# Altium schematic sheet Sheet1.SchDoc
size A; SheetNumber: 1; SheetTotal: 1
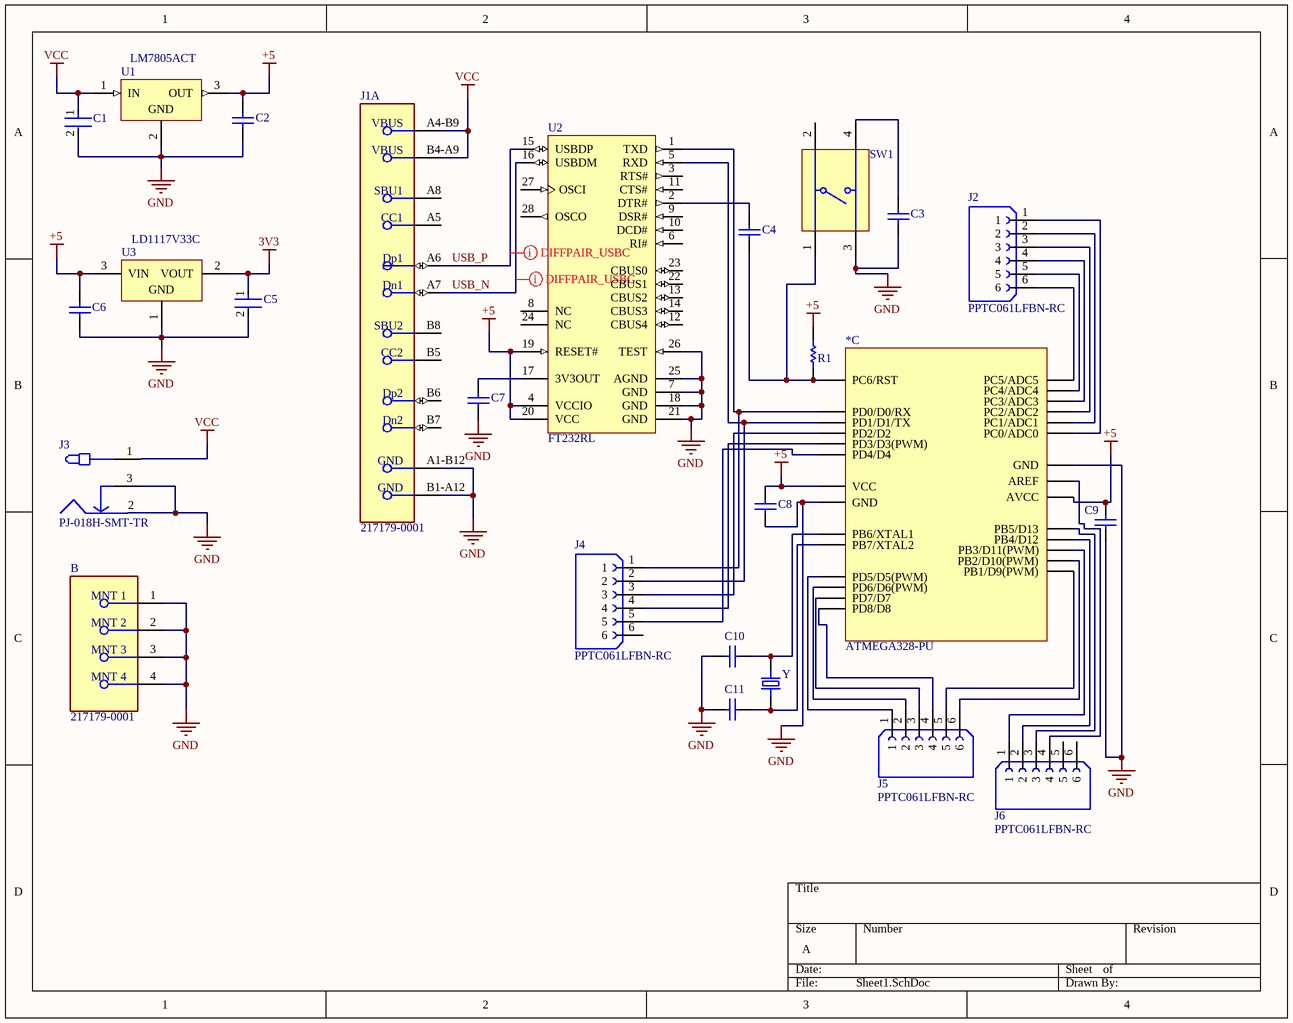
[diagram p0: Sheet1.SchDoc]

## Parts
*  ATMEGA328-PU  [atmega v2 - duplicate]  (part C of 3)
?  217179-0001  [FP-2171790001-MFG]  (part B of 2)
C1  C0805C334K5RACTU  [FP-C0805C-DN-MFG]  (value not drawn)
C2  C0402C104K4RACTU  [CAPC1005X55X30LL05T10]  (value not drawn)
C3  C0402C104K4RACTU  [CAPC1005X55X30LL05T10]  (value not drawn)
C4  C1206C105K5RACTU  [CAPC3216X110X50LL20T25]  (value not drawn)
C5  GRM188R60J106ME47D  [FP-GRM188-0_1-e0_2_0_55-IPC_A]  (value not drawn)
C6  C0402C104K4RACTU  [CAPC1005X55X30LL05T10]  (value not drawn)
C7  C0402C104K4RACTU  [CAPC1005X55X30LL05T10]  (value not drawn)
C8  C0402C104K4RACTU  [CAPC1005X55X30LL05T10]  (value not drawn)
C9  C0402C104K4RACTU  [CAPC1005X55X30LL05T10]  (value not drawn)
C10  GRM1885C1H220JA01D  [CAPC1608X90X35ML10T15]  (value not drawn)
C11  GRM1885C1H220JA01D  [CAPC1608X90X35ML10T15]  (value not drawn)
J1  217179-0001  [FP-2171790001-MFG]  (part A of 2)
J2  PPTC061LFBN-RC  [SULLINS_PPTC061LFBN-RC]
J3  PJ-018H-SMT-TR  [FP-PJ-018H-SMT-TR-MFG]
J4  PPTC061LFBN-RC  [SULLINS_PPTC061LFBN-RC]
J5  PPTC061LFBN-RC  [SULLINS_PPTC061LFBN-RC]
J6  PPTC061LFBN-RC  [SULLINS_PPTC061LFBN-RC]
R1  CRCW060310K0FKEA  [RESC1609X50X30NL8T20]  (value not drawn)
SW1  1825910-6  [TECO-1825910-6_V]  (value not drawn)
U1  LM7805ACT  [FAIR-TO-220-3]
U2  FT232RL  [FTDI-SSOP-28_M]
U3  LD1117V33C  [TO220]
Y  ECS-160-20-3X-TR  [XTAL_ECS-160-20-3X-TR]  (value not drawn)

## Nets
3V3: C5.1 U3.2(VOUT)
+5: *.7(VCC) *.20(AVCC) C2.2 C6.2 C8.2 C9.2 R1.1 U1.3(OUT) U2.4(VCCIO) U2.19(RESET#) U2.20(VCC) U3.3(VIN)
GND: *.8(GND) *.22(GND) ?.1(MNT_1) ?.2(MNT_2) ?.3(MNT_3) ?.4(MNT_4) C1.2 C2.1 C3.1 C5.2 C6.1 C7.1 C8.1 C9.1 C10.1 C11.1 J1.A1-B12(GND) J1.B1-A12(GND) J3.2 J3.3 SW1.3 U1.2(GND) U2.7(GND) U2.18(GND) U2.21(GND) U2.25(AGND) U2.26(TEST) U3.1(GND)
VCC: C1.1 J1.A4-B9(VBUS) J1.B4-A9(VBUS) J3.1 U1.1(IN)
USB_N: J1.A7(Dn1) U2.16(USBDM)
USB_P: J1.A6(Dp1) U2.15(USBDP)
Net*_1: *.1(PC6/RST) C4.1 R1.2 SW1.1
Net*_2: *.2(PD0/D0/RX) J4.1 U2.1(TXD)
Net*_3: *.3(PD1/D1/TX) J4.2 U2.5(RXD)
Net*_4: *.4(PD2/D2) J4.3
Net*_5: *.5(PD3/D3(PWM)) J4.4
Net*_6: *.6(PD4/D4) J4.5
Net*_9: *.9(PB6/XTAL1) C10.2 Y.1
Net*_10: *.10(PB7/XTAL2) C11.2 Y.2
Net*_11: *.11(PD5/D5(PWM)) J5.1
Net*_12: *.12(PD6/D6(PWM)) J5.2
Net*_13: *.13(PD7/D7) J5.3
Net*_14: *.14(PD8/D8) J5.4
Net*_15: *.15(PB1/D9(PWM)) J5.5
Net*_16: *.16(PB2/D10(PWM)) J5.6
Net*_17: *.17(PB3/D11(PWM)) J6.1
Net*_18: *.18(PB4/D12) J6.2
Net*_19: *.19(PB5/D13) J6.3
Net*_21: *.21(AREF) J6.4
Net*_23: *.23(PC0/ADC0) J2.1
Net*_24: *.24(PC1/ADC1) J2.2
Net*_25: *.25(PC2/ADC2) J2.3
Net*_26: *.26(PC3/ADC3) J2.4
Net*_27: *.27(PC4/ADC4) J2.5
Net*_28: *.28(PC5/ADC5) J2.6
NetC3_2: C3.2 SW1.4
NetC4_2: C4.2 U2.2(DTR#)
NetC7_2: C7.2 U2.17(3V3OUT)

Not connected (* = marked no-connect by the designer): J1 A5(CC1) A8(SBU1) B5(CC2) B6(Dp2) B7(Dn2) B8(SBU2); J4 6; J6 5 6; SW1 2; U2 3(RTS#) 6(RI#) 8(NC) 9(DSR#) 10(DCD#) 11(CTS#) 12(CBUS4) 13(CBUS2) 14(CBUS3) 22(CBUS1) 23(CBUS0) 24(NC) 27(OSCI) 28(OSCO)

## Layout directives
differential pair; differential pair class USB_DIFF; net class USB_DIFFPAIR: USB_N, USB_P

## Library data of the parts
* = ATMEGA328-PU: MCU 8-bit ATmega AVR RISC 32KB Flash 2.5V/3.3V/5V 28-Pin PDIP - Rail/Tube; Manufacturer: Microchip; Supplier: Rs; Supplier Part Number: 1310277P; Manufacturer Part Number: ATMEGA328-PU; RoHS: Yes; Category: Microcontrollers; Stock: 1128; Pricing: 25=2.048, 100=1.972 (GBP); Lead Free: 5697LeadFree
? J1 = CMP-04767-000028-2: CONN RCP USB2.0 TYP C 24P SMD RA; NexarPartId: 117190526; Gender: Receptacle; Number of Contacts: 16; Current Rating: 1.25A; Voltage Rating: 30V; Min Operating Temperature: -40°C; USB Standard: USB 2.0; Height: 3.36mm; Contact Material: Gold, Nickel; Max Operating Temperature: 85°C
C1 = CMP-1036-04607-3: CAP CER 0.33UF 50V X7R 0805; Manufacturer: KEMET; Temperature Coefficient: 30ppm/°C; Value: 0.33 μF; Material: Ceramic; Tolerance: 0.1; Temperature: -55°C to +125°C; Temperature Range Low: -55°C; Voltage Rating: 50 V; Lead Free: Yes; Mouser Description: Multilayer Ceramic Capacitors MLCC - SMD/SMT 50volts 0.33uF 10% X7R; Manufacturer Part Number: C0805C334K5RACTU; Automotive: No; Package: C0805C-DN; Temperature Characteristic: X7R; Capacitance: 0.33 μF; Digikey Description: CAP CER 0.33UF 50V X7R 0805; Device Class L3: Ceramic Capacitors; Temperature Range High: +125°C; Category: Cap; Ipc Land Pattern Name: CAPC200125X78; ComponentLink2URL: https://content.kemet.com/datasheets/KEM_C1003_C0G_SMD.pdf; ComponentLink2Description: Datasheet; RoHS: TRUE; Device Class L1: Passive Components; Height: 0.88mm; Octopart: https://octopart.com/c0805c334k5ractu-kemet-10475704; Device Class L2: Capacitors
C2 C3 C6-C9 = CMP-0001-00074-2: 0.1uf; Manufacturer: Kemet; Part Number: C0402C104K4RACTU
C4 = CMP-2000-06011-1: Chip Capacitor, 1 uF, +/- 10%, 50 V, -55 to 125 degC, 1206 (3216 Metric), RoHS, Tape and Reel; Manufacturer: Kemet; Case Height: 1mm; Dielectric: X7R; Voltage Rating: 50V; Capacitance: 1uF; Temperature Coefficient / Code: +/-15%; Case Length: 3.2mm; Case Width: 1.6mm; Type: SMDMLCCX7R6.3-250VDCCommericalGrade; Class: Class1; Capacitance - nF: 1000nF; Datasheet URL: http://www.kemet.com/docfinder?Partnumber=C1206C105K5RACTU; Product Category: MultilayerCeramicCapacitorsMLCC-SMD/SMT; Termination Style: SMD/SMT; Dimensions: 1.6mmWx3.2mmLx1mmH; Voltage Rating DC: 50V; Datasheet Version: 02/2016; Packaging: Reel; Brand: Kemet; RoHS: Details; Minimum Operating Temperature: -55C; Operating Temperature Range: -55Cto+125C; Package Reference: 1206; Manufacturer URL: http://www.kemet.com/; Product: GeneralTypeMLCCs; Tolerance: 10%; Package Description: 2-Pin Surface Mount Device, Body 3.2 x 1.6 mm; Mounting Technology: SurfaceMount; Case Code - mm: 3216; Maximum Operating Temperature: +125C; Series: C1206C; Factory Pack Quantity: 2500; Package / Case: 1206(3216metric); Case Code - in: 1206
C5 = CMP-2006-02792-2: Chip Multilayer Ceramic Capacitors for General Purpose, 0603, 10uF, X5R, 15%, 20%, 6.3V; Packaging: Tape and Reel; Voltage Rating (DC): 6.3V; Width: 0.031inch; Termination: SMD/SMT; Dielectric: X5R; Package Quantity: 4000; Voltage Rating: 6.3V; Capacitance: 10uF; Case/Package: 0603; Min Operating Temperature: -55°C; Voltage: 6.3V; Length: 1.6mm; Thickness: 0.035inch; Lead Free: Lead Free; Depth: 0.8mm; Case Code (Imperial): 0603; Max Operating Temperature: 85°C; Material: Ceramic; Height: 0.8mm; Tolerance: 20%; Mount: Surface Mount; REACH SVHC: No SVHC; Radiation Hardening: No; Case Code (Metric): 1608
C10 C11 = CMP-2000-04945-1: Chip Capacitor, 22 pF, +/- 5%, 50 V, -55 to 125 degC, 0603 (1608 Metric), RoHS, Tape and Reel; Manufacturer: Murata; Capacitance: 22pF; Rated Voltage: 50V; Dielectric: C0G; Manufacturer URL: http://www.murata.com/; Datasheet Version: Jul-06; Package Reference: 603; Tolerance (%): ±5%; Case Size/Dimension: 0603; Package Description: 2-Pin Surface Mount Device, Body 1.6 x 0.8 mm; Datasheet URL: https://datasheet.ciiva.com/11786/0900766b807a1cab-11786398.pdf
J2 J4-J6 = PPTC061LFBN-RC: 6 Position Header Connector 0.100 (2.54mm) Through Hole Tin; MF: Sullins Connector; SnapEDA_Link: https://www.snapeda.com/parts/PPTC061LFBN-RC/Sullins+Connector+Solutions/view-part/?ref=snap; Package: None; Value: *; MP: PPTC061LFBN-RC; Check_prices: https://www.snapeda.com/parts/PPTC061LFBN-RC/Sullins+Connector+Solutions/view-part/?ref=eda
J3 = CMP-14830-000007-1: CONN PWR JACK 1.7X4MM SOLDER; Manufacturer: CUI; Current Rating: 5A; Conn Orientation: Right Angle; Standoff Height: 0.1mm; Conn Gender: Male; Number Of Contacts: 1; Voltage Rating: 24V; Device Class L3: unset; Digikey Description: CONN PWR JACK 1.7X4MM SOLDER; Mouser Description: DC Power Connectors Power Jacks; Category: Conn; Temperature: -25°C to +85°C; Temperature Range High: +85°C; Device Class L2: Power Connectors; Package: 0; Octopart: https://octopart.com/pj-018h-smt-tr-cui-25947163; Automotive: No; Manufacturer Part Number: PJ-018H-SMT-TR; Device Class L1: Connectors; Height: 5.6mm; RoHS: TRUE; Temperature Range Low: -25°C; Contact Material: Nickel,Silver; Lead Free: Yes; ComponentLink2Description: Datasheet; ComponentLink2URL: https://www.cuidevices.com/product/resource/pj-018h-smt-tr.pdf
R1 = CMP-1666-00005-4: Chip Resistor, 10 KOhm, +/- 1%, 100 mW, -55 to 155 degC, 0603 (1608 Metric), RoHS, Tape and Reel; Manufacturer: Vishay Semiconductor; Voltage Rating: 75 V; Max Operating Temperature: 155 degC; PackageDescription: 2-Pin Surface Mount Device, Body 1.575 x 0.85 mm; ComponentLink1Description: Manufacturer URL; RoHSCompliant: true; PackageReference: 0603; REACH SVHC: Unknown; Length: 1.55 mm; DatasheetVersion: 06/2012; Packaging: Tape and Reel; Min Operating Temperature: -55 degC; Mounting Technology: Surface Mount; ComponentLink2URL: https://datasheet.ciiva.com/11809/0900766b80d98afc-11809037.pdf; Height: 0.45 mm; ComponentLink2Description: Datasheet; Package Quantity: 5000; ComponentLink1URL: http://www.vishay.com/
SW1 = CMP-1684-00021-1: Tact Switch, SPST-NO, 0.05 A, -35 to 85 degC, 4-Pin THD, RoHS, Bulk; Manufacturer: TE Connectivity; Maximum Contact Resistance: 100mOhm; Mechanical Life: 100000Cycles; Bushing Type: Unthreaded; Switch Configuration: OFF(ON); Maximum DC Voltage Rating: 24V; Contact Rating @ Voltage: 0.05A@24VDC; Actuator Color: Black; Body Orientation: Straight; Function: MomentaryContact; Illumination: N/R; Actuator Style: RoundButton; Actuator Material: PolybutyleneTerephthalate; Dielectric Strength: 500VAC; Pole Throw Configuration: SPST; Actuator Length: 1.4mm; Product Weight: N/A; Contact Material: CopperAlloy; Housing Material: N/A; Terminal Type: PCPins; Minimum Insulation Resistance: 100MOhm; Package Description: 4-Pin Through Hole Device, Body 5.99 x 5.99 mm, Pitch 6.5 mm; Part No: 1825910-6; Package Reference: THD; Base Material: N/A; Manufacturer URL: http://www.te.com; Contact Plating: Silver; RoHS: Yes; Datasheet Version: Rev. C9; Electrical Life: 100000Cycles; Maximum AC Voltage Rating: N/A; Thread Size: N/R; Operating Temperature: -35to85C; Mounting: ThroughHole; Dimension: 5.99x5mm; Datasheet URL: http://www.te.com/commerce/DocumentDelivery/DDEController?Action=showdoc&DocId=Customer+Drawing%7F1825910%7FC9%7Fpdf%7FEnglish%7FENG_CD_1825910_C9.pdf%7F1825910-6; Family: 1825910; Seal Location: N/A; Seal Description: N/A; Packaging: N/A
U1 = CMP-2000-04937-1: Positive Voltage Regulator, 5 V, 1 A, 0 to 125 degC, 3-Pin TO-220, RoHS, Tube; Manufacturer: Fairchild; Number of Outputs: 1; Typical Dropout Voltage @ Current: 2V@1A; Output Type: Fixed; Output Voltage: 5V; Quiescent Current: 6mA; Dropout Voltage Measurement Current: 1A; Line Regulation: 50mV; Maximum Input Voltage: 35V; Regulator Function: Linear; Load Regulation: 100mV; Package Type: TO-220; Mounting Type: ThroughHole; Height: 16.51mm; Maximum Operating Temperature: +125degC; Datasheet Version: Rev. 1.0.1, 05/2006; Package Reference: TO-220; Minimum Operating Temperature: 0degC; Manufacturer URL: https://www.fairchildsemi.com/; Package URL: https://www.fairchildsemi.com/package-drawings/TO/TO220B03.pdf; Length: 10.67mm; Series: LM78xx; Dimensions: 10.67x4.83x16.51mm; Polarity: Positive; Maximum Output Current: 1A; Pin Count: 3; Width: 4.83mm; Package Description: 3-Pin Through Hole Device, Body 10 x 4.5 mm, Pitch 2.54 mm; Datasheet URL: https://datasheet.ciiva.com/5816/1359194-5816420.pdf
U2 = CMP-2000-05029-1: IC USB FS SERIAL UART 28-SSOP; Manufacturer: FTDI; Receive FIFO: 256B; Number of Channels per Chip: 1; Maximum Data Rate: 3MBd; Transmit FIFO: 128B; Dimensions: 10.2x5.3x1.75mm; Mounting Type: SurfaceMount; Height: 1.75mm; Package Type: SSOP; Datasheet Version: Rev. 1.04, 02/2006; Width: 5.3mm; Manufacturer URL: http://www.ftdichip.com/; Datasheet URL: http://datasheet.octopart.com/FT232RL-FTDI-datasheet-120501.pdf; Maximum Operating Temperature: +85degC; Minimum Operating Temperature: -40degC; Pin Count: 28; Length: 10.2mm
U3 = CMP-0244-00471-1: Fixed Low Drop Positive Voltage Regulator, 3.3V, 3-Pin TO-220; ComponentLink1URL: http://www.st.com; ComponentLink1Description: Manufacturer URL; PackageDescription: TO, Thru-Hole, Vertical, Heatsink Mounted; 3 In-Line Leads; Pitch 2.54 mm; ComponentLink2URL: http://www.st.com/internet/com/TECHNICAL_RESOURCES/TECHNICAL_LITERATURE/DATASHEET/CD00000544.pdf; PackageVersion: ver3.0; ComponentLink2Description: Datasheet; ComponentLink3URL: http://www.st.com/internet/com/TECHNICAL_RESOURCES/TECHNICAL_LITERATURE/PACKAGE_INFORMATION/CD00004649.pdf; ComponentLink3Description: Package Specification; PackageReference: TO220; DatasheetVersion: 1/11/2011
Y = ECS-160-20-3X-TR: 16MHz Â±30ppm Crystal 20pF 50 Ohms HC-49/US; MF: ECS Inc.; Digi-Key_Part_Number: XC1776CT-ND; Digi-Key_Purchase_URL: https://www.digikey.com/product-detail/en/ecs-inc/ECS-160-20-3X-TR/XC1776CT-ND/2676640?utm_source=snapeda&utm_medium=aggregator&utm_campaign=symbol; Package: HC49/US ECS International; MP: ECS-160-20-3X-TR; Value: *; SnapEDA_Link: https://www.snapeda.com/parts/ECS-160-20-3X-TR/ECS%20Inc./view-part/561589/?ref=snap